# Altium schematic sheet Isolation.SchDoc
size A4; CompanyName: Zohm Control GmbH; Address1: Rittersbacher Straße 48c; Address2: 91126 Schwabach; Address3: GERMANY; DocumentNumber: 5; SheetNumber: 5; SheetTotal: 6; Website: www.zohm-control.com
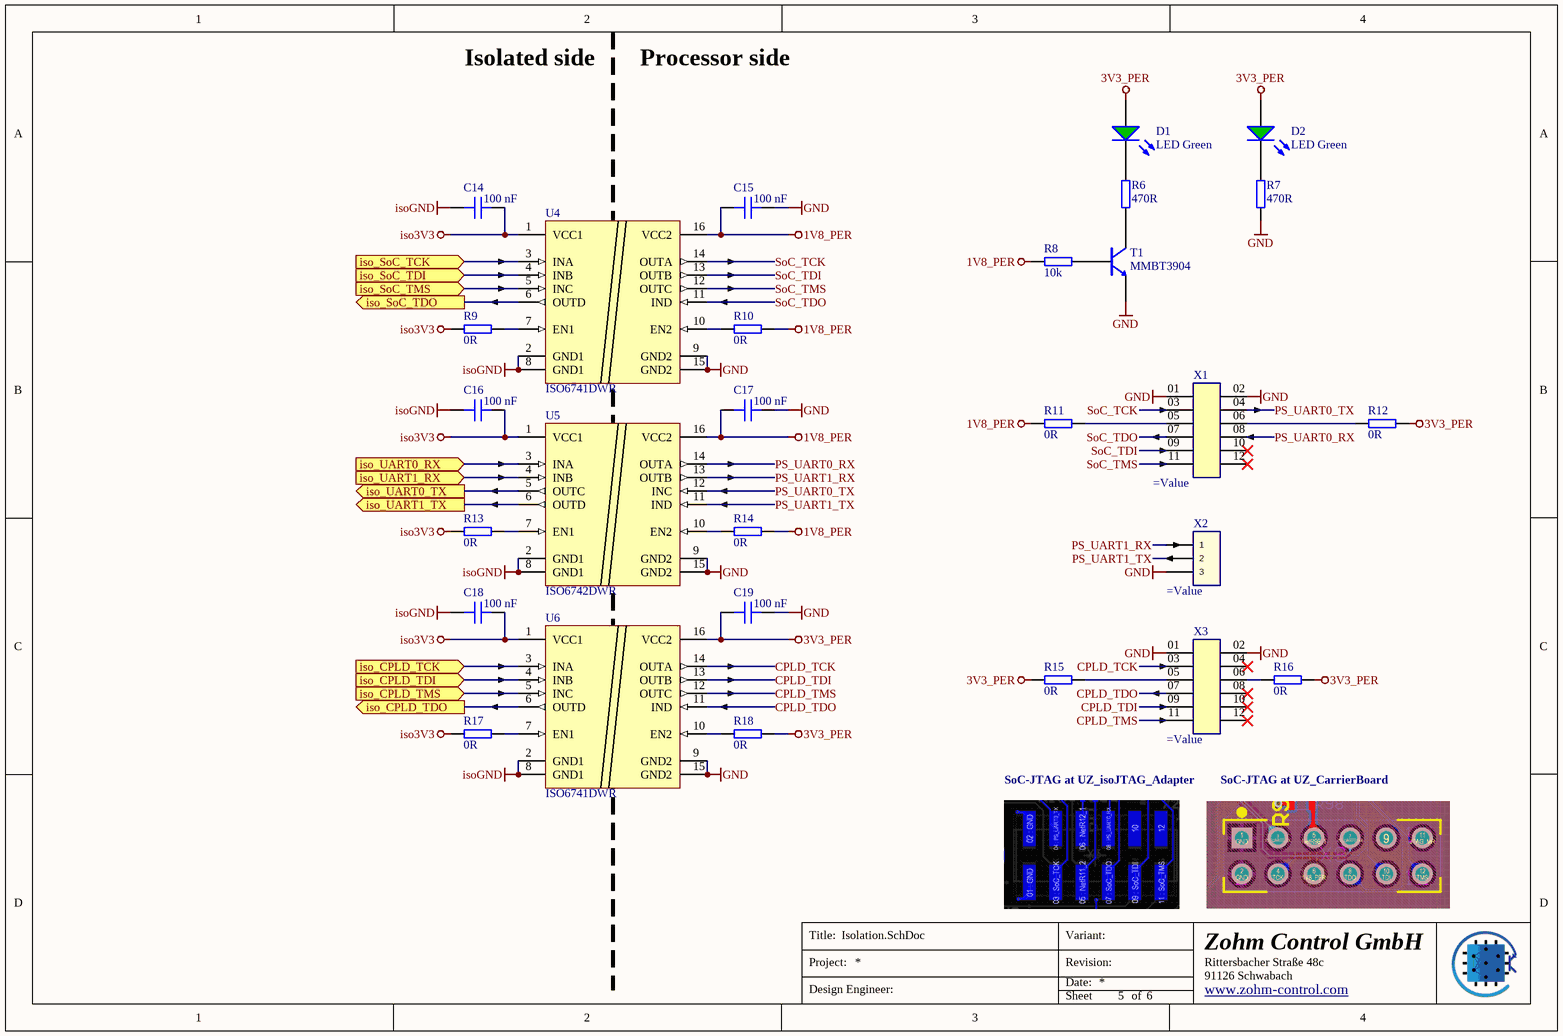
[diagram p0: Isolation.SchDoc]

## Parts
C14  100 nF  [C_0402_TE]
C15  100 nF  [C_0402_TE]
C16  100 nF  [C_0402_TE]
C17  100 nF  [C_0402_TE]
C18  100 nF  [C_0402_TE]
C19  100 nF  [C_0402_TE]
D1  LED Green  [WL-SMCW_0603]
D2  LED Green  [WL-SMCW_0603]
R6  470R  [RES 0603_1608]
R7  470R  [RES 0603_1608]
R8  10k  [RES 0603_1608]
R9  0R  [R_0402_TE]
R10  0R  [R_0402_TE]
R11  0R  [R_0402_TE]
R12  0R  [R_0402_TE]
R13  0R  [R_0402_TE]
R14  0R  [R_0402_TE]
R15  0R  [R_0402_TE]
R16  0R  [R_0402_TE]
R17  0R  [R_0402_TE]
R18  0R  [R_0402_TE]
T1  MMBT3904  [SOT-23-3]
U4  ISO6741DWR  [SOIC127P1030X265-16N]
U5  ISO6742DWR  [SOIC127P1030X265-16N]
U6  ISO6741DWR  [SOIC127P1030X265-16N]
X1  (no value)  [SSW-106-22-F-D-VS]
X2  (no value)  [TSW-103-XX-XXX-S]
X3  (no value)  [TSM-106-01-L-DV]

## Ports
iso_CPLD_TCK (in), iso_CPLD_TDI (in), iso_CPLD_TDO (out), iso_CPLD_TMS (in), iso_SoC_TCK (in), iso_SoC_TDI (in), iso_SoC_TDO (out), iso_SoC_TMS (in), iso_UART0_RX (in), iso_UART0_TX (out), iso_UART1_RX (in), iso_UART1_TX (out)

## Nets
1V8_PER: C15.2 C17.2 R8.2 R10.2 R11.1 R14.2 U4.16(VCC2) U5.16(VCC2)
3V3_PER: C19.2 D1.2(A) D2.2(A) R12.2 R15.1 R16.2 R18.2 U6.16(VCC2)
GND: C15.1 C17.1 C19.1 R7.1 T1.2(EMITTER) U4.9(GND2) U4.15(GND2) U5.9(GND2) U5.15(GND2) U6.9(GND2) U6.15(GND2) X1.01 X1.02 X2.3 X3.01 X3.02
iso3V3: C14.1 C16.1 C18.1 R9.1 R13.1 R17.1 U4.1(VCC1) U5.1(VCC1) U6.1(VCC1)
isoGND: C14.2 C16.2 C18.2 U4.2(GND1) U4.8(GND1) U5.2(GND1) U5.8(GND1) U6.2(GND1) U6.8(GND1)
CPLD_TCK: U6.14(OUTA) X3.03
CPLD_TDI: U6.13(OUTB) X3.09
CPLD_TDO: U6.11(IND) X3.07
CPLD_TMS: U6.12(OUTC) X3.11
iso_CPLD_TCK: U6.3(INA) ; port iso_CPLD_TCK
iso_CPLD_TDI: U6.4(INB) ; port iso_CPLD_TDI
iso_CPLD_TDO: U6.6(OUTD) ; port iso_CPLD_TDO
iso_CPLD_TMS: U6.5(INC) ; port iso_CPLD_TMS
iso_SoC_TCK: U4.3(INA) ; port iso_SoC_TCK
iso_SoC_TDI: U4.4(INB) ; port iso_SoC_TDI
iso_SoC_TDO: U4.6(OUTD) ; port iso_SoC_TDO
iso_SoC_TMS: U4.5(INC) ; port iso_SoC_TMS
iso_UART0_RX: U5.3(INA) ; port iso_UART0_RX
iso_UART0_TX: U5.5(OUTC) ; port iso_UART0_TX
iso_UART1_RX: U5.4(INB) ; port iso_UART1_RX
iso_UART1_TX: U5.6(OUTD) ; port iso_UART1_TX
PS_UART0_RX: U5.14(OUTA) X1.08
PS_UART0_TX: U5.12(INC) X1.04
PS_UART1_RX: U5.13(OUTB) X2.1
PS_UART1_TX: U5.11(IND) X2.2
SoC_TCK: U4.14(OUTA) X1.03
SoC_TDI: U4.13(OUTB) X1.09
SoC_TDO: U4.11(IND) X1.07
SoC_TMS: U4.12(OUTC) X1.11
NetD1_1: D1.1(K) R6.2
NetD2_1: D2.1(K) R7.2
NetR6_1: R6.1 T1.3(COLLECTOR)
NetR8_1: R8.1 T1.1(BASIS)
NetR9_2: R9.2 U4.7(EN1)
NetR10_1: R10.1 U4.10(EN2)
NetR11_2: R11.2 X1.05
NetR12_1: R12.1 X1.06
NetR13_2: R13.2 U5.7(EN1)
NetR14_1: R14.1 U5.10(EN2)
NetR15_2: R15.2 X3.05
NetR16_1: R16.1 X3.06
NetR17_2: R17.2 U6.7(EN1)
NetR18_1: R18.1 U6.10(EN2)

Not connected (* = marked no-connect by the designer): X1 10* 12*; X3 04* 08* 10* 12*

## Notes on the sheet
- Isolated side
- Processor side
- SoC-JTAG at UZ_isoJTAG_Adapter
- SoC-JTAG at UZ_CarrierBoard
- Title:
- Project:
- Date:
- Revision:
- Variant:
- Design Engineer:
- Sheet
- of

## Library data of the parts
C14-C19 = GRM155R71H104KE14D: 50V 100nF X7R ±10% 0402 Multilayer Ceramic Capacitors MLCC - SMD/SMT ROHS; Manufacturer: Murata Electronics; Voltage Rating: 50 VDC; Created from: AGeiger; Manufacturer Part Number: GRM155R71H104KE14D; PartID: 144; Created On: 13.12.2023 22:03:54; ComponentLink1Description: Datasheet; ComponentLink1URL: https://datasheet.lcsc.com/lcsc/1809272047_Murata-Electronics-GRM155R71H104KE14D_C77020.pdf; Component Type: Capacitor 0402; Device Package: 0402; Last Updated: 13.12.2023 22:03:54; Mounting Type: SMD; Operating Temperature: -55 to +125°C; Series: X7R; Supplier 1: LCSC; Supplier Part Number 1: C77020; Type: Capacitor; Tolerance: 10 %; Value: 100 nF; Live Cycle Status: 1; LCSC Part Number: C77020
D1 D2 = 19-217/GHC-YR1S2/3T: LED GREEN 520~535NM 112~258MCD@20MA TOP VIEW 0603 ROHS; Manufacturer: Everlight Elec; Type: Standard; Created from: T. Wendt; Forward Current I_f: 20 mA; Forward Voltage U_f: 3.3 V; Wavelength: 530 nm; Light Intensity: 285 mcd; Nominal Power: 83 mW; Manufacturer Part Number: 19-217/GHC-YR1S2/3T; PartID: 7; Created On: 03.03.2021 10:06:23; ComponentLink1Description: Datasheet; ComponentLink1URL: https://datasheet.lcsc.com/szlcsc/Everlight-Elec-19-217-GHC-YR1S2-3T_C72043.pdf; Component Type: LED Diode; Device Package: 0603; Last Updated: 04.03.2021 09:02:49; Mounting Type: SMD; Operating Temperature: -40 - 85 °C; Supplier 1: LCSC; Supplier Part Number 1: C72043; Supplier 2: Mouser; Supplier Part Number 2: 638-19217GHCYR1S23T; Live Cycle Status: 1; Stock number: not stored; Color: green; LCSC Part Number: C72043
R6 R7 = RK73B1JTTD471J: SMD resistor E24 series; Manufacturer: KOA Speer; Tolerance: 5%; Created from: MGremer; Manufacturer Part Number: RK73B1JTTD471J; PartID: 66; Created On: 14.12.2020 16:17:14; ComponentLink1Description: Datasheet; ComponentLink1URL: https://www.mouser.de/datasheet/2/219/RK73B-1825463.pdf; Component Type: SMD resistor; Device Package: 0603; Last Updated: 04.03.2021 10:03:02; Mounting Type: SMD; Supplier 1: Mouser; Supplier Part Number 1: 660-RK73B1JTTD471J; Supplier 2: LCSC; Supplier Part Number 2: C23179; Type: Resistor; Value: 470R; Live Cycle Status: 1; Stock number: Labor SMD Container; LCSC Part Number: C23179
R8 = 0603WAF1002T5E: SMD resistor 1%; Manufacturer: UNI-ROYAL; Created from: AGeiger; Manufacturer Part Number: 0603WAF1002T5E; PartID: 265; Created On: 01.06.2023 06:49:29; ComponentLink1Description: Datasheet; ComponentLink1URL: https://datasheet.lcsc.com/lcsc/2206010045_UNI-ROYAL-Uniroyal-Elec-0603WAF1002T5E_C25804.pdf; Component Type: SMD resistor; Device Package: 0603; Last Updated: 01.06.2023 06:49:29; Mounting Type: SMD; Supplier 1: LCSC; Supplier Part Number 1: C25804; Type: Resistor; Tolerance: 1%; Value: 10k; Live Cycle Status: 1; LCSC Part Number: C25804
R9-R18 = RC0402JR-070RL: 62.5mW Thick Film Resistors 50V 0Ω 0402 Chip Resistor - Surface Mount ROHS; Manufacturer: YAGEO; Tolerance: 1%; Created from: AGeiger; Manufacturer Part Number: RC0402JR-070RL; PartID: 310; Created On: 17.12.2023 14:16:27; ComponentLink1Description: Datasheet; ComponentLink1URL: https://datasheet.lcsc.com/lcsc/2304140030_YAGEO-RC0402JR-070RL_C60485.pdf; Component Type: SMD resistor; Device Package: 0402; Last Updated: 17.12.2023 14:16:27; Mounting Type: SMD; Supplier 1: LCSC; Supplier Part Number 1: C60485; Type: Resistor; Value: 0R; Live Cycle Status: 1; LCSC Part Number: C60485
T1 = MMBT3904: 40V 200mW 100@10mA,1V 200mA NPN SOT-23 Bipolar Transistors - BJT ROHS; Manufacturer: Jiangsu Changjing Electronics Technology; Type: NPN Bipolar Transistor; Value: 40V, 200mA; Created from: AGeiger; Manufacturer Part Number: MMBT3904; PartID: 5; Created On: 01.06.2023 08:49:03; ComponentLink1Description: Datasheet; ComponentLink1URL: https://datasheet.lcsc.com/lcsc/2207041900_Jiangsu-Changjing-Electronics-Technology-Co---Ltd--MMBT3904_C20526.pdf; Component Type: NPN Bipolar Transistor; Device Package: SOT-23-3; Last Updated: 01.06.2023 08:49:03; Mounting Type: SMD; Operating Temperature: -55 to +150 °C; Series: MMBT3904; Supplier 1: LCSC; Supplier Part Number 1: C20526; Live Cycle Status: 1; LCSC Part Number: C20526; Stock number: not stored
U4 U6 = ISO6741DWR: Digital Isolators General-purpose, quad-channel, 3/1 digital isolator 16-SOIC -40 to 125; Manufacturer: Texas Instruments; Created from: AGeiger; Manufacturer Part Number: ISO6741DWR; PartID: 1; Created On: 26.11.2023 18:06:34; ComponentLink1Description: Datasheet; ComponentLink1URL: https://www.ti.com/general/docs/suppproductinfo.tsp?distId=26&gotoUrl=https://www.ti.com/lit/gpn/iso6741; Component Type: Digital Isolator; Device Package: SOIC-16; Last Updated: 26.11.2023 18:06:34; Mounting Type: SMD; Operating Temperature: -40 to +125 °C; Series: ISO6741; Supplier 1: Mouser; Supplier Part Number 1: 595-ISO6741DWR; Type: Digital Isolator; Value: ISO6741DWR; LCSC Part Number: C5216432
U5 = ISO6742DWR: Digital Isolators General-purpose, quad-channel, 2/2 digital isolator; Manufacturer: Texas Instruments; Created from: AGeiger; Manufacturer Part Number: ISO6742DWR; PartID: 2; Created On: 26.11.2023 18:17:11; ComponentLink1Description: Datasheet; ComponentLink1URL: https://www.ti.com/general/docs/suppproductinfo.tsp?distId=26&gotoUrl=https://www.ti.com/lit/gpn/iso6742; Component Type: Digital Isolator; Device Package: SOIC-16; Last Updated: 26.11.2023 18:17:11; Mounting Type: SMD; Operating Temperature: -40 to +125 °C; Series: ISO6742; Supplier 1: Mouser; Supplier Part Number 1: 595-ISO6742DWR; Type: Digital Isolator; Value: ISO6742DWR; LCSC Part Number: C9900001820
X1 = SSW-106-22-F-D-VS: Tiger Buy™ Socket Strip with PCB Tails, .100" Pitch; Manufacturer: SAMTEC; Created from: AGeiger; Manufacturer Part Number: SSW-106-22-F-D-VS; PartID: 25; Created On: 17.12.2023 19:38:46; ComponentLink1Description: Datasheet; ComponentLink1URL: https://suddendocs.samtec.com/catalog_english/ssw_sm.pdf; Last Updated: 17.12.2023 19:38:46; Mounting Type: SMD; Operating Temperature: -55 °C to +105 °C; Series: SSW; Supplier 1: LCSC; Supplier Part Number 1: C2689175; Value: SSW-106-22-F-D-VS; LCSC Part Number: C2689175
X2 = TSW-103-07-L-S: Classic PCB Header Strips, 0.100" pitch; Manufacturer: SAMTEC; Created from: AGeiger; Created: 2020_11_26_AGeiger; Manufacturer Part Number: TSW-103-07-L-S; Value: TSW-103-07-L-S; PartID: 21; Created On: 26.06.2023 09:53:59; ComponentLink1Description: Datasheet; ComponentLink1URL: https://suddendocs.samtec.com/catalog_english/tsw_th.pdf; Last Updated: 26.06.2023 09:53:59; Mounting Type: SMD; Operating Temperature: -55 °C to +105 °C; Series: TSW; Supplier 1: LCSC; Supplier Part Number 1: C2937625; LCSC Part Number: C2937625
X3 = TSM-106-01-L-DV: .100" Surface Mount Terminal Strip; Manufacturer: SAMTEC; Created from: AGeiger; Manufacturer Part Number: TSM-106-01-L-DV; PartID: 26; Created On: 20.12.2023 09:27:24; ComponentLink1Description: Datasheet; ComponentLink1URL: https://suddendocs.samtec.com/catalog_english/tsm.pdf; Last Updated: 20.12.2023 09:27:24; Mounting Type: SMD; Operating Temperature: -55 °C to +105 °C; Series: TSM; Supplier 1: LCSC; Supplier Part Number 1: C180236; Value: TSM-106-01-L-DV; LCSC Part Number: C180236